# EAGLE design encoder-tester (EAGLE 6.6.0)
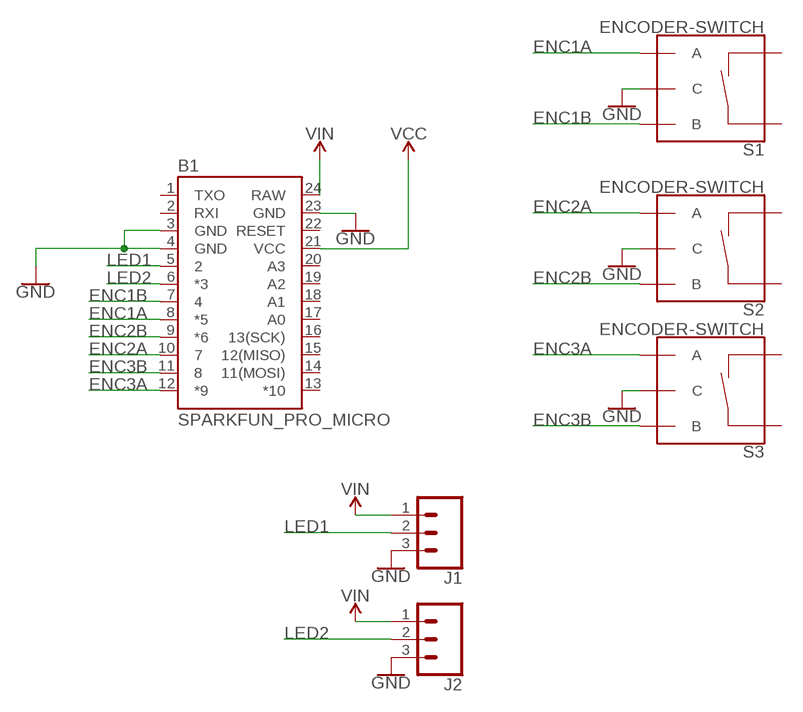
[diagram p0: schematic, sheet 1]

## Parts
B1  SPARKFUN_PRO_MICRO  [SPARKFUN_PRO_MICRO]
J1  CONN_03  [1X03]
J2  CONN_03  [1X03]
S1  ENCODER-SWITCH  [ROTARY_ENC_PLAIN]
S2  ENCODER-SWITCH  [ROTARY_ENC_PLAIN]
S3  ENCODER-SWITCH  [ROTARY_ENC_PLAIN]

## Nets
ENC1A: B1.8(*5) S1.A
ENC1B: B1.7 S1.B
ENC2A: B1.10 S2.A
ENC2B: B1.9(*6) S2.B
ENC3A: B1.12(*9) S3.A
ENC3B: B1.11 S3.B
GND: B1.3(GND) B1.4(GND) B1.23(GND) J1.3 J2.3 S1.C S2.C S3.C
LED1: B1.5 J1.2
LED2: B1.6(*3) J2.2
VCC: B1.21(VCC)
VIN: B1.24(RAW) J1.1 J2.1
Unconnected: B1.1(TXO) B1.2(RXI) B1.13(*10) B1.14(11(MOSI)) B1.15(12(MISO)) B1.16(13(SCK)) B1.17(A0) B1.18(A1) B1.19(A2) B1.20(A3) B1.22(RESET) S1.SW+ S1.SW- S2.SW+ S2.SW- S3.SW+ S3.SW-

## Library data of the parts
B1 = SparkFun-Boards:SPARKFUN_PRO_MICRO: SparkFun Pro Micro Atmega32U4 compatible footprint. SparkFun Products: 3.3V/8MHz <https://www.sparkfun.com/products/12587> 5V/16MHz <https://www.sparkfun.com/products/12640>
J1 J2 = SparkFun-Connectors:CONN_03: Multi connection point. Often used as Generic Header-pin footprint for 0.1 inch spaced/style header connections On any of the 0.1 inch spaced packages, you can populate with these: Break Away Headers - Straight <https://www.sparkfun.com/products/116> (PRT-00116) Break Away Male Headers - Right Angle <https://www.sparkfun.com/products/553> (PRT-00553) Female Headers <https://www.sparkfun.com/products/115> (PRT-00115) Break Away Headers - Machine Pin <https://www.sparkfun.com/products/117> (PRT-00117) Break Away Female Headers - Swiss Machine Pin <https://www.sparkfun.com/products/743> (PRT-00743) Stackable Header - 3 Pin (Female, 0.1") <https://www.sparkfun.com/products/13875> (PRT-13875) For SCREWTERMINALS and SPRING TERMINALS visit here: Screw Terimnals on SparkFun.com <https://www.sparkfun.com/search/results?term=Screw+Terminals> (5mm/3.5mm/2.54mm spacing) This device is also useful as a general connection point to wire up your design to another part of your project. Our various solder wires solder well into these plated through hole pads. Hook-Up Wire - Assortment (Stranded, 22 AWG) <https://www.sparkfun.com/products/11375> (PRT-11375) Hook-Up Wire - Assortment (Solid Core, 22 AWG) <https://www.sparkfun.com/products/11367> (PRT-11367) View the entire wire category on our website here <https://www.sparkfun.com/categories/141> Special notes: Molex polarized connector foot print use with SKU : PRT-08232 with associated crimp pins and housings.
S1-S3 = SparkFun-Switches:ENCODER-SWITCH: Rotary Encoder w/ Select Switch Encoders rotate similarly to potentiometers, but they’re different from potentiometers in that an encoder has full rotation without limits. They output gray code so that you can tell how much and in which direction the encoder has been turned. This encoder includes a push-down select switch built into the shaft. SparkFun Products Rotary Encoder <https://www.sparkfun.com/products/9117> (COM-09117); SF_SKU: COM-09117

## Board
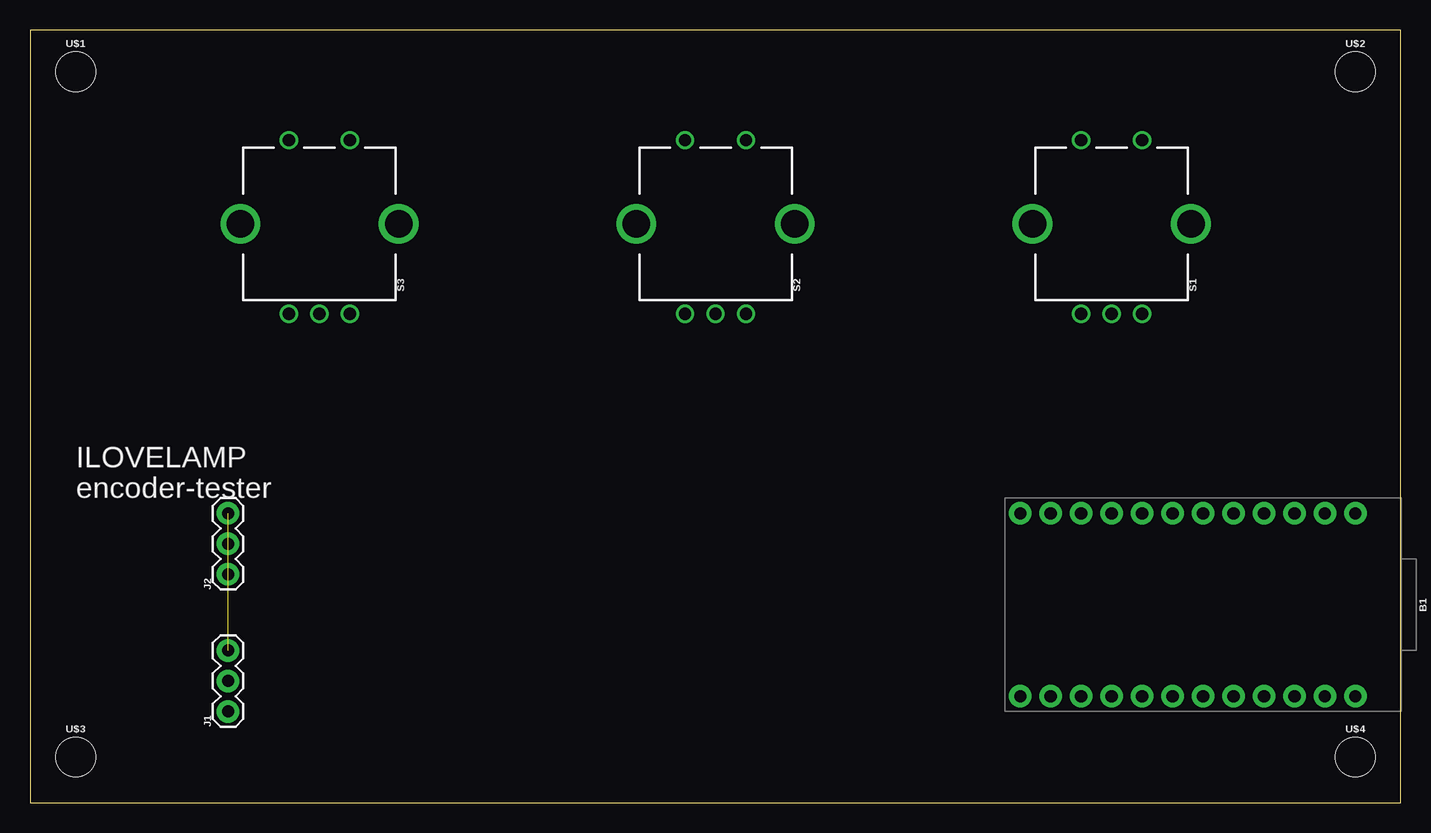
[diagram p1: board, top side]
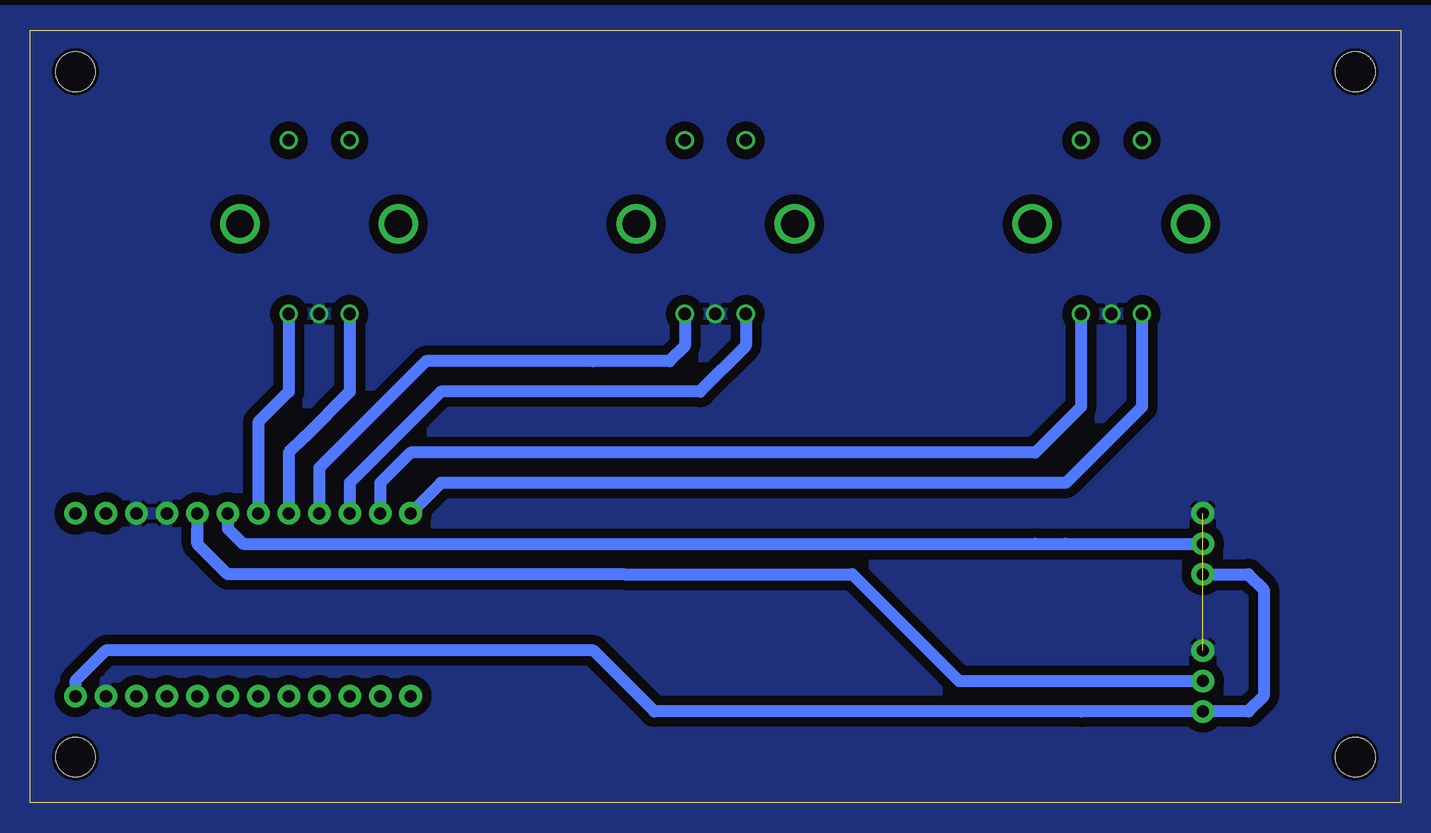
[diagram p2: board, bottom side, seen from below]

Size 114.28 x 64.44 mm. Coordinates in mm from the lower left corner, seen from the top.
Outline: 0,0 114.28,0 114.28,64.44 0,64.44 0,0
Copper layers (1*16): Top 0.035mm / dielectric 1.5mm / Bottom 0.035mm
Design rules "OthermillDRC_1_32_v2": minimum track width 8mil, minimum drill 0.8mm, track to track 0.794003125mm, track to pad 0.794003125mm, pad to pad 0.794003125mm, via to via 0.794003125mm, smd to smd 0mil, copper to edge 0mil, drill to drill 1mil, minimum pad ring 10mil, minimum via ring 10mil, stop-mask expansion 1mil, vias tented up to drill 30mil, thermal gap 10mil

### Footprints (pad centres in the part's own frame; a part is rotated, then mirrored left to right if it is on the bottom)
SPARKFUN_PRO_MICRO = drill 1.016 pad 1.88: 1 -7.62,12.7; 2 -7.62,10.16; 3 -7.62,7.62; 4 -7.62,5.08; 5 -7.62,2.54; 6 -7.62,0; 7 -7.62,-2.54; 8 -7.62,-5.08; 9 -7.62,-7.62; 10 -7.62,-10.16; 11 -7.62,-12.7; 12 -7.62,-15.24; 13 7.62,-15.24; 14 7.62,-12.7; 15 7.62,-10.16; 16 7.62,-7.62; 17 7.62,-5.08; 18 7.62,-2.54; 19 7.62,0; 20 7.62,2.54; 21 7.62,5.08; 22 7.62,7.62; 23 7.62,10.16; 24 7.62,12.7
1X03 = drill 1.016 pad 1.88: 1 0,0; 2 2.54,0; 3 5.08,0
ROTARY_ENC_PLAIN = drill 1.016: A 7.493,-2.54; B 7.493,2.54; C 7.493,0; SW+ -6.985,2.54; SW- -6.985,-2.54 | drill 2.286: P$3 0,6.604; P$4 0,-6.604
STAND-OFF = hole 3.302: 0,0

### Placement (x,y rotation side)
B1  97.79,16.51 270 top
J1  16.51,7.62 90 top
J2  16.51,19.05 90 top
S1  90.17,48.26 270 top
S2  57.15,48.26 270 top
S3  24.13,48.26 270 top
U$1  [STAND-OFF]  3.81,60.96 0 top
U$2  [STAND-OFF]  110.49,60.96 0 top
U$3  [STAND-OFF]  3.81,3.81 0 top
U$4  [STAND-OFF]  110.49,3.81 0 top

### Tracks (layer width: path | path; a pad name or v marks a point on that pad's centre or on a via)
ENC1A
  Bottom 1.016: S1.A 87.63,34.29 91.44,30.48 92.71,29.21 B1.8
ENC1B
  Bottom 1.016: S1.B 92.71,34.29 95.25,31.75 B1.7
ENC2A
  Bottom 1.016: S2.A 54.61,38.1 58.42,34.29 80.01,34.29 87.63,26.67 B1.10
ENC2B
  Bottom 1.016: B1.9 90.17,26.67 90.17,27.94 88.9,29.21 81.28,36.83 67.31,36.83 60.96,36.83 59.69,38.1 S2.B
ENC3A
  Bottom 1.016: S3.A 21.59,33.02 27.94,26.67 80.01,26.67 B1.12
ENC3B
  Bottom 1.016: S3.B 26.67,34.29 26.67,33.02 30.48,29.21 82.55,29.21 85.09,26.67 B1.11
GND  (1 unrouted)
  pour Bottom: 118.11,66.04 -2.54,66.04 -2.54,-2.54 118.11,-2.54
LED1
  Bottom 1.016: B1.5 100.33,22.86 | 100.33,22.86 100.33,21.59 | 100.33,21.59 97.79,19.05 64.77,19.05 45.72,19.05 36.83,10.16 J1.2 | 100.33,21.59 100.33,22.86
LED2
  Bottom 1.016: B1.6 97.79,22.86 96.52,21.59 30.48,21.59 27.94,21.59 J2.2
VIN
  Bottom 1.016: 26.67,7.62 12.7,7.62 11.43,8.89 11.43,17.78 12.7,19.05 J2.1 | 26.67,7.62 62.23,7.62 67.31,12.7 107.95,12.7 110.49,10.16 B1.24 | J1.1 26.67,7.62

### Text on the board
tPlace: ILOVELAMP | encoder-tester